# Altium schematic sheet 04 MCU.SchDoc
size A3
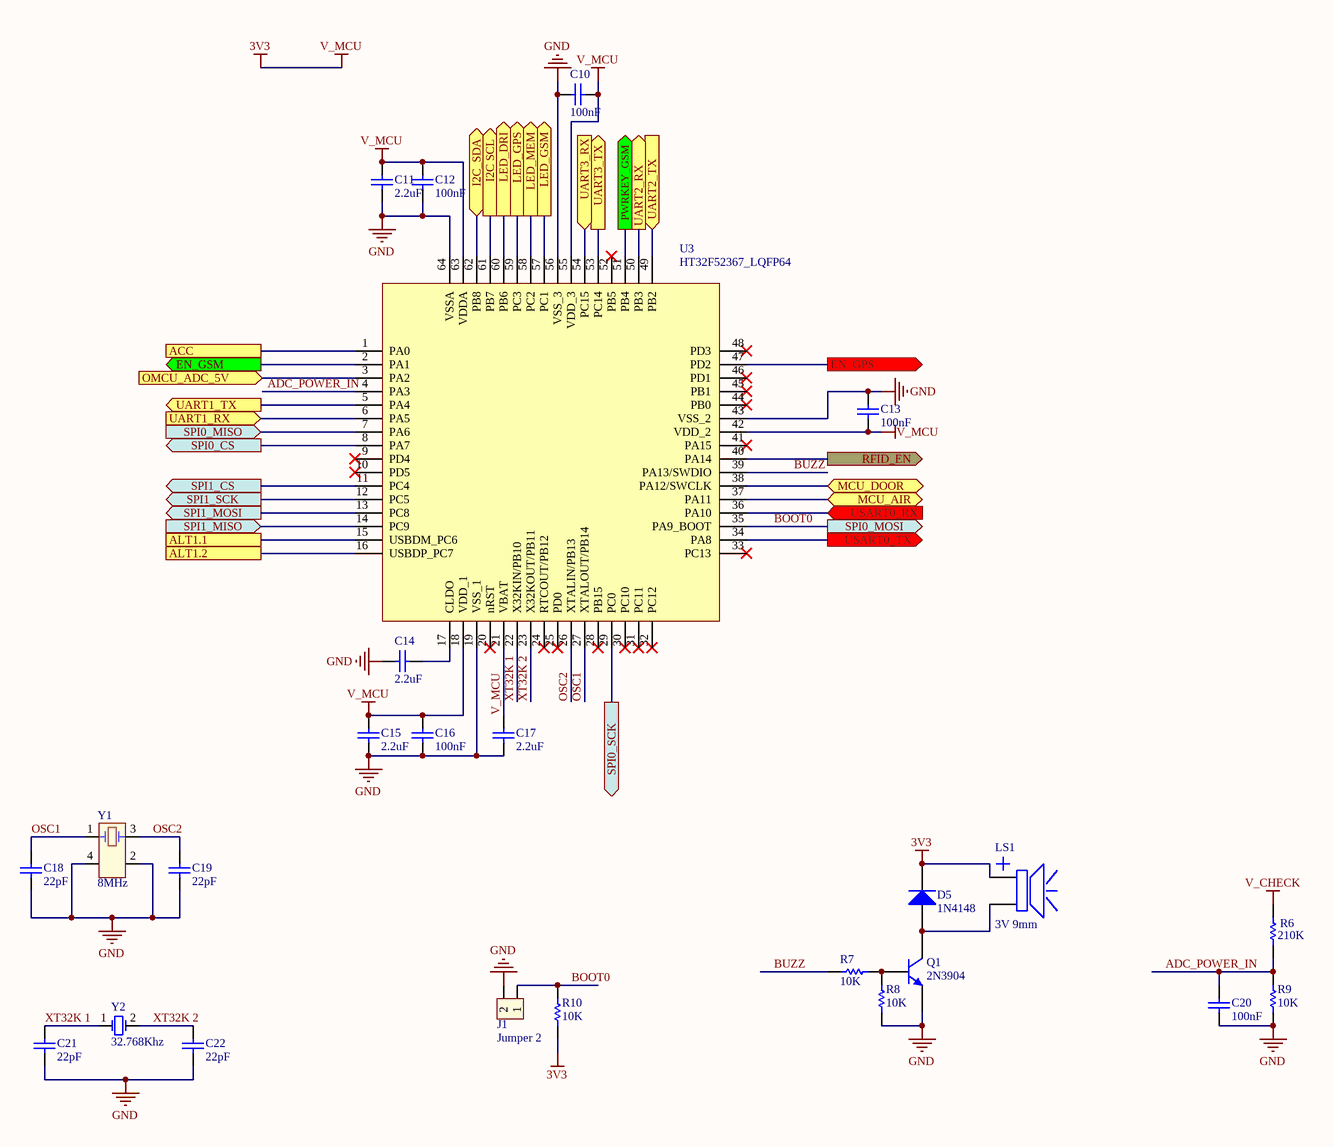
[diagram p0: 04 MCU.SchDoc]

## Parts
C10  100nF  [0603 - C]
C11  2.2uF  [0603 - C]
C12  100nF  [0603 - C]
C13  100nF  [0603 - C]
C14  2.2uF  [0603 - C]
C15  2.2uF  [0603 - C]
C16  100nF  [0603 - C]
C17  2.2uF  [0603 - C]
C18  22pF  [0603 - C]
C19  22pF  [0603 - C]
C20  100nF  [0603 - C]
C21  22pF  [0603 - C]
C22  22pF  [0603 - C]
D5  1N4148  [SOD-123]
J1  Jumper 2  [JP2]
LS1  3V 9mm  [Buzzer]
Q1  2N3904  [SOT23B]
R6  210K  [0603 - R]
R7  10K  [0603 - R]
R8  10K  [0603 - R]
R9  10K  [0603 - R]
R10  10K  [0603 - R]
U3  HT32F52367_LQFP64  [HT_LQFP64]
Y1  8MHz  [Crystal 3225]
Y2  32.768Khz  [Crystal 3215]

## Ports
ACC, ALT1.1, ALT1.2, EN_GPS (out), EN_GSM (out), I2C SCL (out), I2C_SDA (bidir), LED_DRI (out), LED_GPS (out), LED_GSM (out), LED_MEM (out), MCU_AIR (bidir), MCU_DOOR (bidir), OMCU_ADC_5V (in), PWRKEY_GSM (out), RFID_EN (out), SPI0_CS (out), SPI0_MISO (in), SPI0_MOSI (out), SPI0_SCK (out), SPI1_CS (out), SPI1_MISO (in), SPI1_MOSI (out), SPI1_SCK (out), UART1_RX (in), UART1_TX (out), UART2_RX (out), UART2_TX (in), UART3_RX (in), UART3_TX (out), USART0_RX (in), USART0_TX (out)

## Nets
GND: C10.1 C11.1 C12.1 C13.2 C14.1 C15.1 C16.1 C17.1 C18.1 C19.1 C20.1 C21.1 C22.1 J1.2 Q1.2(E) R8.1 R9.1 U3.19(VSS_1) U3.43(VSS_2) U3.56(VSS_3) U3.64(VSSA) Y1.2(GND) Y1.4(GND)
V_CHECK: R6.2
V_MCU: C10.2 C11.2 C12.2 C13.1 C15.2 C16.2 C17.2 D5.2(K) LS1.1 R10.1 U3.18(VDD_1) U3.21(VBAT) U3.42(VDD_2) U3.55(VDD_3) U3.63(VDDA)  [also labelled 3V3]
ACC: U3.1(PA0) ; port ACC
ADC_POWER_IN: C20.2 R6.1 R9.2 U3.4(PA3)
ALT1.1: U3.15(USBDM_PC6) ; port ALT1.1
ALT1.2: U3.16(USBDP_PC7) ; port ALT1.2
BOOT0: J1.1 R10.2 U3.35(PA9_BOOT) ; port SPI0_MOSI
BUZZ: R7.2 U3.39(PA13/SWDIO)
EN_GPS: U3.47(PD2) ; port EN_GPS
EN_GSM: U3.2(PA1) ; port EN_GSM
I2C SCL: U3.61(PB7) ; port I2C SCL
I2C_SDA: U3.62(PB8) ; port I2C_SDA
LED_DRI: U3.60(PB6) ; port LED_DRI
LED_GPS: U3.59(PC3) ; port LED_GPS
LED_GSM: U3.57(PC1) ; port LED_GSM
LED_MEM: U3.58(PC2) ; port LED_MEM
MCU_AIR: U3.37(PA11) ; port MCU_AIR
MCU_DOOR: U3.38(PA12/SWCLK) ; port MCU_DOOR
OMCU_ADC_5V: U3.3(PA2) ; port OMCU_ADC_5V
OSC1: C18.2 U3.27(XTALOUT/PB14) Y1.1(OSC1)
OSC2: C19.2 U3.26(XTALIN/PB13) Y1.3(OSC2)
PWRKEY_GSM: U3.51(PB4) ; port PWRKEY_GSM
RFID_EN: U3.40(PA14) ; port RFID_EN
SPI0_CS: U3.8(PA7) ; port SPI0_CS
SPI0_MISO: U3.7(PA6) ; port SPI0_MISO
SPI0_SCK: U3.29(PC0) ; port SPI0_SCK
SPI1_CS: U3.11(PC4) ; port SPI1_CS
SPI1_MISO: U3.14(PC9) ; port SPI1_MISO
SPI1_MOSI: U3.13(PC8) ; port SPI1_MOSI
SPI1_SCK: U3.12(PC5) ; port SPI1_SCK
UART1_RX: U3.6(PA5) ; port UART1_RX
UART1_TX: U3.5(PA4) ; port UART1_TX
UART2_RX: U3.50(PB3) ; port UART2_RX
UART2_TX: U3.49(PB2) ; port UART2_TX
UART3_RX: U3.54(PC15) ; port UART3_RX
UART3_TX: U3.53(PC14) ; port UART3_TX
USART0_RX: U3.36(PA10) ; port USART0_RX
USART0_TX: U3.34(PA8) ; port USART0_TX
XT32K 1: C21.2 U3.22(X32KIN/PB10) Y2.1(OSC1)
XT32K 2: C22.2 U3.23(X32KOUT/PB11) Y2.2(GND)
NetC14_2: C14.2 U3.17(CLDO)
NetD5_1: D5.1(A) LS1.2 Q1.3(C)
NetQ1_1: Q1.1(B) R7.1 R8.2

Not connected (* = marked no-connect by the designer): U3 9(PD4)* 10(PD5)* 20(nRST)* 24(RTCOUT/PB12)* 25(PD0)* 28(PB15)* 30(PC10)* 31(PC11)* 32(PC12)* 33(PC13)* 41(PA15)* 44(PB0)* 45(PB1)* 46(PD1)* 48(PD3)* 52(PB5)*

## Library data of the parts
C10 C12 C13 C16 C20 = Cap 0603 100nF: CAP CER 100nF 50V C0G/NP0 0603 ±5%; MPN: CL10C104JB8NNNC; MFR: SAMSUNG; Company ID: VT_CAP_C0603 100nF; Voltage: 50V; Package: 0603; Size: C0603: 100nF; Value: 100nF
C11 C14 C15 C17 = Cap 0603 2.2uF: CAP CER 2.2UF 16V X7R 0603; MPN: CL10A225KQ8NNNC; MFR: SAMSUNG; Company ID: VT_CAP_C0603 2.2uF; Size: C0603: 2.2uF; Value: 2.2uF
C18 C19 C21 C22 = Cap 0603 22pF: CAP CER 22PF 50V C0G/NP0 0603; MPN: CL10C220JB8NNNC; MFR: SAMSUNG; Company ID: VT_CAP_C0603 22pF; Value: 22pF; Size: C0603: 22pF
D5 = Diode 1N4148: DIODE GEN PURP 100V 300MA SOD123; MPN: 1N4148W-7-F; MFR: DIODES; Company ID: VT_DIODE_1N4148W-7-F
J1 = JP2: Jumper 2, 2.54mmx2; Value: J3
LS1 = Speaker: Buzzer 9*6mm (D*h); MFR: China; MPN: TMB09A03; Company ID: VT_Buzzer 3V 9mm
Q1 = Transistor 2N3904: TRANS NPN 40V 0.2A SOT-23; MPN: MMBT3904; MFR: Fairchild; Company ID: VT_TRANSISTOR_3904
R6 = Res 0603 210K: RES SMD 210K OHM 1% 1/10W 0603; MFR: Yageo; MPN: RC0603FR-07210KL; Company ID: VT_RES_R0603 210K; Size: R0603: 210K; Value: 210K
R7-R10 = Res 0603 10K: RES SMD 10K OHM 1% 1/10W 0603; MFR: Yageo; MPN: RC0603FR-0710KL; Company ID: VT_RES_R0603 10K; Value: 10K; Size: R0603: 10K
Y1 = XTAL 8MHz 3225: CRYSTAL 8.0MHZ 10PF SMD; MFR: Taisaw; MPN: TZ3313B; Company ID: VT_CRYSTAL_SMD 8M 3225
Y2 = XTAL ABS07-32.768KHz: CRYSTAL 32.7680KHZ 12.5PF SMD; MFR: Abracon LLC; MPN: ABS07-32.768KHZ-T; Company ID: VT_CRYSTAL_SMD 32.768KHz  2P; MPN2: FC-135 32.7680KA-A5
U3 = HT32F52367_LQFP64: Mpn: *; Value: *; Mfr: *